# Altium schematic sheet TLD.SchDoc
size A; SheetNumber: 1; SheetTotal: 4
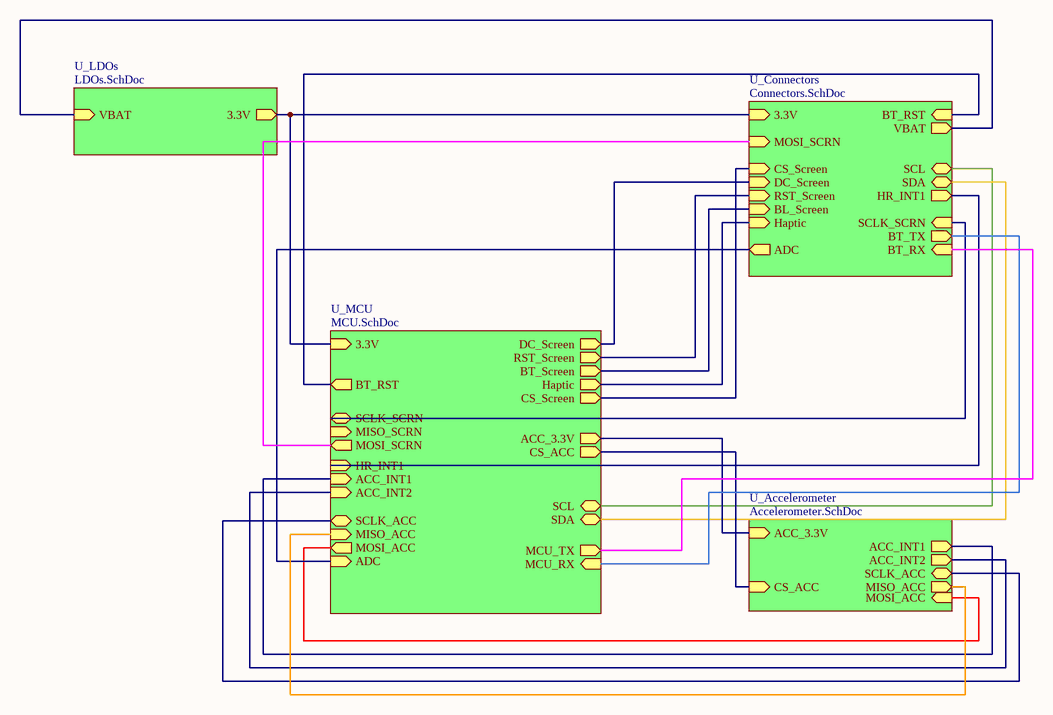
[diagram p0: TLD.SchDoc]

## Sub-sheets
U_Accelerometer = Accelerometer.SchDoc: ACC_INT1 (out), ACC_INT2 (out), CS_ACC (in), ACC_3.3V (in), SCLK_ACC (bidir), MISO_ACC (out), MOSI_ACC (in)
U_Connectors = Connectors.SchDoc: Haptic (in), 3.3V (in), CS_Screen (in), DC_Screen (in), RST_Screen (in), BL_Screen (in), SDA (bidir), HR_INT1 (out), SCL (bidir), BT_TX (out), BT_RX (in), VBAT (out), BT_RST (in), ADC (out), MOSI_SCRN (in), SCLK_SCRN (in)
U_LDOs = LDOs.SchDoc: 3.3V (out), VBAT (in)
U_MCU = MCU.SchDoc: 3.3V (in), Haptic (out), BT_Screen (out), RST_Screen (out), DC_Screen (out), CS_Screen (out), CS_ACC (out), HR_INT1 (in), ACC_INT1 (in), ACC_INT2 (in), ACC_3.3V (out), MCU_TX (out), MCU_RX (in), SCL (bidir), SDA (bidir), BT_RST (out), ADC (in), SCLK_SCRN (bidir), MISO_SCRN (in), MOSI_SCRN (out), SCLK_ACC (bidir), MISO_ACC (in), MOSI_ACC (out)

## Nets
(unnamed): sheet U_Connectors/Haptic, sheet U_MCU/Haptic
(unnamed): sheet U_Connectors/3.3V, sheet U_MCU/3.3V, sheet U_LDOs/3.3V
(unnamed): sheet U_Connectors/CS_Screen, sheet U_MCU/CS_Screen
(unnamed): sheet U_Connectors/DC_Screen, sheet U_MCU/DC_Screen
(unnamed): sheet U_Connectors/RST_Screen, sheet U_MCU/RST_Screen
(unnamed): sheet U_Connectors/BL_Screen, sheet U_MCU/BT_Screen
(unnamed): sheet U_Connectors/SDA, sheet U_MCU/SDA
(unnamed): sheet U_Connectors/HR_INT1, sheet U_MCU/HR_INT1
(unnamed): sheet U_Connectors/SCL, sheet U_MCU/SCL
(unnamed): sheet U_Connectors/BT_TX, sheet U_MCU/MCU_RX
(unnamed): sheet U_Connectors/BT_RX, sheet U_MCU/MCU_TX
(unnamed): sheet U_Connectors/VBAT, sheet U_LDOs/VBAT
(unnamed): sheet U_Connectors/BT_RST, sheet U_MCU/BT_RST
(unnamed): sheet U_Connectors/ADC, sheet U_MCU/ADC
(unnamed): sheet U_Connectors/MOSI_SCRN, sheet U_MCU/MOSI_SCRN
(unnamed): sheet U_Connectors/SCLK_SCRN, sheet U_MCU/SCLK_SCRN
(unnamed): sheet U_MCU/CS_ACC, sheet U_Accelerometer/CS_ACC
(unnamed): sheet U_MCU/ACC_INT1, sheet U_Accelerometer/ACC_INT1
(unnamed): sheet U_MCU/ACC_INT2, sheet U_Accelerometer/ACC_INT2
(unnamed): sheet U_MCU/ACC_3.3V, sheet U_Accelerometer/ACC_3.3V
(unnamed): sheet U_MCU/SCLK_ACC, sheet U_Accelerometer/SCLK_ACC
(unnamed): sheet U_MCU/MISO_ACC, sheet U_Accelerometer/MISO_ACC
(unnamed): sheet U_MCU/MOSI_ACC, sheet U_Accelerometer/MOSI_ACC